# EasyEDA Pro project icl7109-rp2040-precision-meter_2025-05-16.epro, schematic icl7109-rp2040-precision-meter
Board Name: 树莓派Board1_4; Create Date: 2025-05-10; Page Name: P1; Project Name: ICL7109检测电路; Schematic Name: 树莓派Schematic1_4; Update Date: 2025-05-13; Company: 嘉立创EDA; Page Size: A4; Version: V1.0
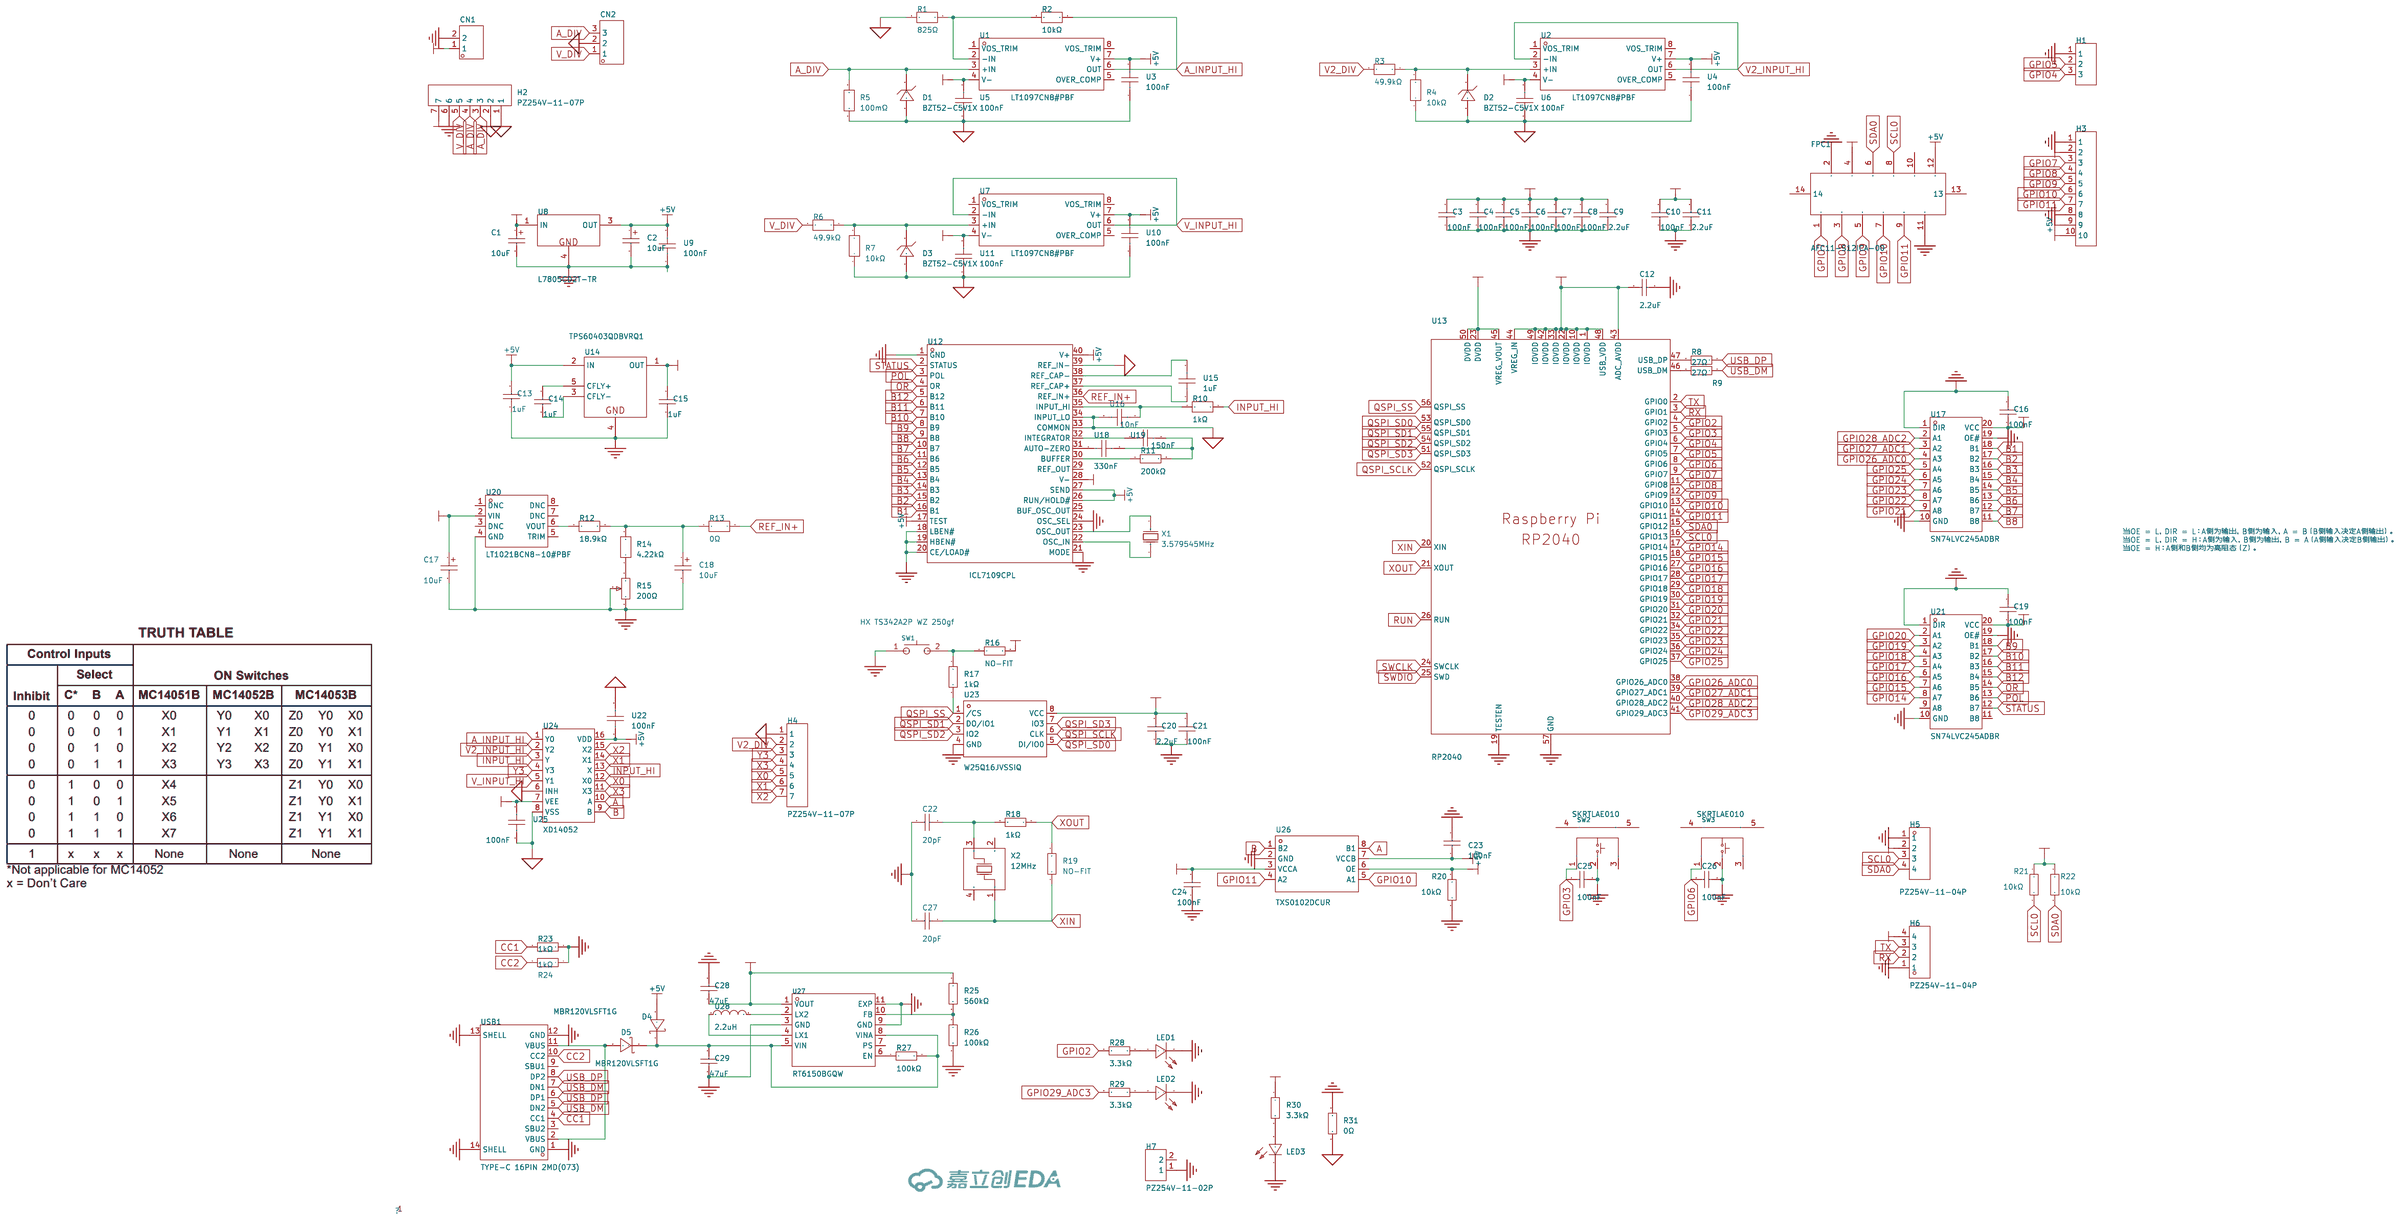
[diagram p0: schematic sheet]

## Parts
C1  10uF  [CAP-SMD_L7.3-W4.3-FD]
C2  10uF  [case-b_3528]
C3  100nF  [C0805]
C4  100nF  [C0805]
C5  100nF  [C0805]
C6  100nF  [C0805]
C7  100nF  [C0805]
C8  100nF  [C0805]
C9  2.2uF  [C0805]
C10  100nF  [C0805]
C11  2.2uF  [C0805]
C12  2.2uF  [C0805]
C13  1uF  [C0805]
C14  1uF  [C0805]
C15  1uF  [C0805]
C16  100nF  [C0805]
C17  10uF  [CAP-SMD_L7.3-W4.3-FD]
C18  10uF  [case-b_3528]
C19  100nF  [C0805]
C20  2.2uF  [C0805]
C21  100nF  [C0805]
C22  20pF  [C0805]
C23  100nF  [C0805]
C24  100nF  [C0805]
C25  100nF  [C0805]
C26  100nF  [C0805]
C27  20pF  [C0805]
C28  47uF  [C0805]
C29  47uF  [C0805]
CN1  WJ15EDGVC-3.81-2P  [CONN-TH_WJ15EDGVC-3.81-2P]
CN2  WJ15EDGVC-3.81-3P  [CONN-TH_3P-P3.81_WJ15EDGVC-3.81-3P]
D1  BZT52-C5V1X  [SOD-123_L2.7-W1.6-LS3.7-RD]
D2  BZT52-C5V1X  [SOD-123_L2.7-W1.6-LS3.7-RD]
D3  BZT52-C5V1X  [SOD-123_L2.7-W1.6-LS3.7-RD]
D4  MBR120VLSFT1G  [SOD-123F_L2.8-W1.8-LS3.7-RD]
D5  MBR120VLSFT1G  [SOD-123F_L2.8-W1.8-LS3.7-RD]
FPC1  AFC11-S12ICA-00  [CONN-SMD-12P_AFC11-S12ICA-00]
H1  PZ254V-11-03P  [HDR-TH_3P-P2.54-V-M]
H2  PZ254V-11-07P  [HDR-TH_7P-P2.54-V-M]
H3  PZ254V-11-10P  [HDR-TH_10P-P2.54-V-M]
H4  PZ254V-11-07P  [HDR-TH_7P-P2.54-V-M]
H5  PZ254V-11-04P  [HDR-TH_4P-P2.54-V-M]
H6  PZ254V-11-04P  [HDR-TH_4P-P2.54-V-M]
H7  PZ254V-11-02P  [HDR-TH_2P-P2.54-V-M]
LED1  LTST-C190KSKT  [LED0603-RD]
LED2  LTST-C190KSKT  [LED0603-RD]
LED3  NCD0603R1  [LED0603-RD_RED]
R1  825Ω  [RES-TH_BD2.7-L6.2-P10.20-D0.4]
R2  10kΩ  [RES-TH_BD2.7-L6.2-P10.20-D0.4]
R3  49.9kΩ  [RES-TH_BD2.7-L6.2-P10.20-D0.4]
R4  10kΩ  [RES-TH_BD2.7-L6.2-P10.20-D0.4]
R5  100mΩ  [RES-SMD_L6.4-W3.2-R2512]
R6  49.9kΩ  [RES-TH_BD2.7-L6.2-P10.20-D0.4]
R7  10kΩ  [RES-TH_BD2.7-L6.2-P10.20-D0.4]
R8  27Ω  [r0805]
R9  27Ω  [r0805]
R10  1kΩ  [RES-TH_BD2.7-L6.2-P10.20-D0.4]
R11  200kΩ  [R1206]
R12  18.9kΩ  [RES-TH_BD2.7-L6.2-P10.20-D0.4]
R13  0Ω  [RES-TH_BD2.7-L6.2-P10.20-D0.4]
R14  4.22kΩ  [RES-TH_BD2.7-L6.2-P10.20-D0.4]
R15  200Ω  [RES-ADJ-TH_3P-L9.5-W9.5-P2.54-BR-BS]
R16  NO-FIT  [r0805]
R17  1kΩ  [r0805]
R18  1kΩ  [r0805]
R19  NO-FIT  [r0805]
R20  10kΩ  [r0805]
R21  10kΩ  [r0805]
R22  10kΩ  [r0805]
R23  1kΩ  [r0805]
R24  1kΩ  [r0805]
R25  560kΩ  [R0603]
R26  100kΩ  [R0603]
R27  100kΩ  [R0603]
R28  3.3kΩ  [r0805]
R29  3.3kΩ  [r0805]
R30  3.3kΩ  [r0805]
R31  0Ω  [R1206]
SW1  HX TS342A2P WZ 250gf  [SW-SMD_L4.0-W2.9-LS5.0]
SW2  SKRTLAE010  [KEY-SMD_SKRTLAE010]
SW3  SKRTLAE010  [KEY-SMD_SKRTLAE010]
U1  LT1097CN8#PBF  [PDIP-8_L9.3-W6.4-P2.54-LS7.6-BL]
U2  LT1097CN8#PBF  [PDIP-8_L9.3-W6.4-P2.54-LS7.6-BL]
U3  100nF  [CAP-TH_L3.8-W2.5-P5.08-D0.50]
U4  100nF  [CAP-TH_L3.8-W2.5-P5.08-D0.50]
U5  100nF  [CAP-TH_L3.8-W2.5-P5.08-D0.50]
U6  100nF  [CAP-TH_L3.8-W2.5-P5.08-D0.50]
U7  LT1097CN8#PBF  [PDIP-8_L9.3-W6.4-P2.54-LS7.6-BL]
U8  L7805CD2T-TR  [TO-263-2_L10.0-W9.1-P5.08-LS15.2-TL]
U9  100nF  [CAP-TH_L3.8-W2.5-P5.08-D0.50]
U10  100nF  [CAP-TH_L3.8-W2.5-P5.08-D0.50]
U11  100nF  [CAP-TH_L3.8-W2.5-P5.08-D0.50]
U12  ICL7109CPL  [PDIP-40_L52.3-W13.8-P2.54-LS15.2-BL]
U13  RP2040  [LQFN-56_L7.0-W7.0-P0.4-EP]
U14  TPS60403QDBVRQ1  [SOT-23-5_L3.0-W1.7-P0.95-LS2.8-BR]
U15  1uF  [CAP-TH_L13.0-W5.0-P10.00-D0.6]
U16  10nF  [CAP-TH_L3.8-W2.5-P5.08-D0.50]
U17  SN74LVC245ADBR  [SSOP-20_L7.5-W5.2-P0.65-LS8.0-BL]
U18  330nF  [CAP-TH_L18.0-W6.0-P15.00-D0.8]
U19  150nF  [CAP-TH_L13.0-W5.0-P10.00-D0.6]
U20  LT1021BCN8-10#PBF  [PDIP-8_L9.3-W6.4-P2.54-LS7.6-BL]
U21  SN74LVC245ADBR  [SSOP-20_L7.5-W5.2-P0.65-LS8.0-BL]
U22  100nF  [CAP-TH_L3.8-W2.5-P5.08-D0.50]
U23  W25Q16JVSSIQ  [SOIC-8_L5.3-W5.3-P1.27-LS8.0-BL]
U24  XD14052  [DIP-16_L19.2-W6.6-P2.54-LS7.6-BL]
U25  100nF  [CAP-TH_L3.8-W2.5-P5.08-D0.50]
U26  TXS0102DCUR  [VSON8_L2.0-W2.3-P0.50-LS3.1-BL]
U27  RT6150BGQW  [WSON-10_L2.5-W2.5-P0.50-BL-EP]
U28  2.2uH  [IND-SMD_L2.5-W2.0-B]
USB1  TYPE-C 16PIN 2MD(073)  [USB-C-SMD_TYPE-C-6PIN-2MD-073]
X1  3.579545MHz  [HC-49US_L11.5-W4.5-P4.88]
X2  12MHz  [OSC-SMD_4P-L3.2-W2.5-BL]

## Library data of the parts
C1 C17 = T491X476K035AT: 容值:47uF;精度:±10%;额定电压:35V;等效串联电阻:600mΩ@100kHz;; LCSC Part Name: 47uF ±10% 35V; Supplier Part: C87110; Manufacturer: KEMET(基美); Supplier Footprint: CASE-X-7343; JLCPCB Part Class: 扩展库; Datasheet: https://atta.szlcsc.com/upload/public/pdf/source/20190402/C118128_17DC26F5D7668F0165447CB640F1E367.pdf; Supplier: LCSC; Tolerance: ±10%; Rated Voltage: 35V; Equivalent Series Resistance(ESR): 600mΩ@100kHz; Operating Temperature: -55℃~+125℃
C2 C18 = T491B106K025AT: 容值:10uF;精度:±10%;额定电压:25V;等效串联电阻:2Ω@100kHz;; LCSC Part Name: 10uF ±10% 25V; Supplier Part: C110053; Manufacturer: KEMET(基美); Supplier Footprint: CASE-B-3528-21(mm); JLCPCB Part Class: 扩展库; Datasheet: https://atta.szlcsc.com/upload/public/pdf/source/20190402/C118128_17DC26F5D7668F0165447CB640F1E367.pdf; Supplier: LCSC; Tolerance: ±10%; Rated Voltage: 25V; Equivalent Series Resistance(ESR): 2Ω@100kHz; Operating Temperature: -55℃~+125℃
C3-C16 C19-C22 C25-C29 = CC0805KRX7R9BB104: 容值:100nF;精度:±10%;额定电压:50V;材质(温度系数):X7R;; LCSC Part Name: 100nF ±10% 50V; Supplier Part: C49678; Manufacturer: YAGEO(国巨); Supplier Footprint: 0805; JLCPCB Part Class: 基础库; Datasheet: https://atta.szlcsc.com/upload/public/pdf/source/20180224/C181747_15194369449651363981.pdf; Supplier: LCSC; Tolerance: ±10%; Voltage Rated: 50V; Temperature Coefficient: X7R
C23 C24 = 0805B104K500NT: 容值:100nF;精度:±10%;额定电压:50V;材质(温度系数):X7R;; LCSC Part Name: 100nF ±10% 50V; Supplier Part: C38141; Manufacturer: FH(风华); Supplier Footprint: 0805; JLCPCB Part Class: 扩展库; Datasheet: https://atta.szlcsc.com/upload/public/pdf/source/20200305/C486355_26A10D38EF8C2A5C37091D0039909270.pdf; Supplier: LCSC; Tolerance: ±10%; Voltage Rated: 50V; Temperature Coefficient: X7R
CN1 = WJ15EDGVC-3.81-2P: 连接器类型:板端/插座-闭口;固定方式:-;结构:1x2P;间距:3.81mm;颜色:-;安装方式:直针;排数:1;每排PIN数:2;额定电流:8A;额定电压:300V;线规 - AWG:-;线规 - 平方毫米:-;触头材质:黄铜;触头镀层:锡;工作温度范围:-40℃~+105℃;焊接温度(最大值):-;; LCSC Part Name: 1x2P 3.81mm 排数:1 每排P数:2; Supplier Part: C8396; Manufacturer: KANGNEX(康奈克斯电气); Supplier Footprint: 插件,P=3.81mm; JLCPCB Part Class: 扩展库; Datasheet: https://atta.szlcsc.com/upload/public/pdf/source/20191225/C8396_DFFE6D58C2AF45781C2AF0BF2B733CCC.pdf; Supplier: LCSC; Connector Type: 板端/插座-闭口; Structure: 1x2P; Pitch: 3.81mm; Mounting Style: 直针; Number of Pins: 2P; Number of Rows: 1; Number of PINs Per Row: 2; Current Rating (Max): 8A; Voltage Rating (Max): 300V; Contact Material: 黄铜; Contact Plating: 锡; Operating Temperature Range: -40℃~+105℃
CN2 = WJ15EDGVC-3.81-3P: 连接器类型:板端/插座-闭口;固定方式:-;结构:1x3P;间距:3.81mm;颜色:-;安装方式:直针;排数:1;每排PIN数:3;额定电流:8A;额定电压:300V;线规 - AWG:-;线规 - 平方毫米:-;触头材质:黄铜;触头镀层:锡;工作温度范围:-40℃~+105℃;焊接温度(最大值):-;; LCSC Part Name: 1x3P 3.81mm 排数:1 每排P数:3; Supplier Part: C8389; Manufacturer: KANGNEX(康奈克斯电气); Supplier Footprint: 插件,P=3.81mm; JLCPCB Part Class: 扩展库; Datasheet: https://atta.szlcsc.com/upload/public/pdf/source/20191225/C8389_B21BE5A0E910B8F69CE6926ACBB2B491.pdf; Supplier: LCSC; Connector Type: 板端/插座-闭口; Structure: 1x3P; Pitch: 3.81mm; Mounting Style: 直针; Number of Pins: 3P; Number of Rows: 1; Number of PINs Per Row: 3; Current Rating (Max): 8A; Voltage Rating (Max): 300V; Contact Material: 黄铜; Contact Plating: 锡; Operating Temperature Range: -40℃~+105℃
D1-D3 = BZT52-C5V1X: 稳压值(标称值):5.1V;功率(Pd):350mW;; Supplier Part: C550301; Manufacturer: Nexperia(安世); Supplier Footprint: SOD-123; JLCPCB Part Class: 扩展库; Datasheet: https://atta.szlcsc.com/upload/public/pdf/source/20200610/C550302_6745180D178DB30731460AF0B8A8D2F3.pdf; Supplier: LCSC; Zener Voltage (Nom): 5.1V; Reverse Leakage Current (Ir): 2uA@2V; Power Dissipation: 350mW; Zener Impedance (Zzt): 60Ω
D4 D5 = MBR120VLSFT1G: 正向压降(Vf):300mV@1A;直流反向耐压(Vr):20V;平均整流电流(Io):1A;; LCSC Part Name: 电压:20V 电流:1A; Supplier Part: C223608; Manufacturer: onsemi(安森美); Supplier Footprint: SOD-123FL; JLCPCB Part Class: 扩展库; Datasheet: https://atta.szlcsc.com/upload/public/pdf/source/20221020/29D26ECD33A75D76A8E47ED9553F3BCF.pdf; Supplier: LCSC; Forward Voltage (Vf@If): 300mV@1A; Reverse Voltage (Vr): 20V; Average Rectified Current (Io): 1A; Reverse Leakage Current (Ir): 600uA@20V
FPC1 = AFC11-S12ICA-00: 锁定特性:抽屉式;触点类型:单侧触点/垂直;触点数量:12P;间距:0.5mm;安装类型:立贴;; LCSC Part Name: 间距:0.5mm P数:12P 抽屉式 单侧触点/垂直; Supplier Part: C262499; Manufacturer: JS(钜硕电子); Supplier Footprint: SMD,P=0.5mm; JLCPCB Part Class: 扩展库; Datasheet: https://atta.szlcsc.com/upload/public/pdf/source/20191211/C466537_F6F2472ADACFFA77E875AFE9DAB8E0AD.pdf; Supplier: LCSC; Locking Feature: 抽屉式; Contact Type: 单侧触点/垂直; Number of Contacts: 12P; Pitch: 0.5mm; Mounting Type: 立贴; FFC, FCB Thickness: 0.3mm; Height Above Board: 4.4mm
H1 = PZ254V-11-03P: 插针结构:1x3P;间距:2.54mm;行距:-;圆针/方针:方针;安装方式:直插;排数:单排;总PIN位数:3P;额定电流:3A;额定电压:250V;配合针长度:6mm;塑高:2.5mm;端接针长度:3mm;工作温度:-40℃~+105℃;颜色:黑色;; LCSC Part Name: 1x3P 间距:2.54mm 方针 直插; Supplier Part: C2937625; Manufacturer: XFCN(兴飞); Supplier Footprint: 插件,P=2.54mm; JLCPCB Part Class: 扩展库; Datasheet: https://atta.szlcsc.com/upload/public/pdf/source/20200309/C492402_8335C3D49C4E4C618838D59BB1D024C1.pdf; Supplier: LCSC; Pin Structure: 1x3P; Pitch: 2.54mm; Circluar Pins/Square Pins: 方针; Mounting Type: 直插; Number of Rows: 单排; Number of Pins: 3P; Current Rating: 3A; Voltage Rating (Max): 250V; Length of Mating Pin: 6mm; Insulation Height: 2.5mm; Length of End Connection Pin: 3mm; Operating Temperature: -40℃~+105℃; Color: 黑色
H2 H4 = PZ254V-11-07P: 插针结构:1x7P;间距:2.54mm;行距:-;圆针/方针:方针;安装方式:直插;排数:单排;总PIN位数:7P;额定电流:-;额定电压:-;配合针长度:6mm;塑高:2.5mm;端接针长度:3mm;触头材质:黄铜;触头镀层:-;工作温度:-40℃~+105℃;颜色:黑色;; LCSC Part Name: 1x7P 间距:2.54mm 方针 直插; Supplier Part: C492406; Manufacturer: XFCN(兴飞); Supplier Footprint: 插件,P=2.54mm; JLCPCB Part Class: 扩展库; Datasheet: https://atta.szlcsc.com/upload/public/pdf/source/20200309/C492406_654C533EE691117E22DD9F76C114C2D9.pdf; Supplier: LCSC; Pin Structure: 1x7P; Pitch: 2.54mm; Circluar Pins/Square Pins: 方针; Mounting Type: 直插; Number of Rows: 单排; Number of Pins: 7P; Length of Mating Pin: 6mm; Insulation Height: 2.5mm; Length of End Connection Pin: 3mm; Contact Material: 黄铜; Operating Temperature: -40℃~+105℃; Color: 黑色
H3 = PZ254V-11-10P: 插针结构:1x10P;间距:2.54mm;行距:-;圆针/方针:方针;安装方式:直插;排数:单排;总PIN位数:10P;额定电流:-;额定电压:-;配合针长度:6mm;塑高:2.5mm;端接针长度:3mm;触头材质:黄铜;触头镀层:-;工作温度:-40℃~+105℃;颜色:黑色;; LCSC Part Name: 1x10P 间距:2.54mm 方针 直插; Supplier Part: C492409; Manufacturer: XFCN(兴飞); Supplier Footprint: 插件,P=2.54mm; JLCPCB Part Class: 扩展库; Datasheet: https://atta.szlcsc.com/upload/public/pdf/source/20200309/C492409_129C9431BDD62EBBBD0A643B6AAB9FBD.pdf; Supplier: LCSC; Pin Structure: 1x10P; Pitch: 2.54mm; Circluar Pins/Square Pins: 方针; Mounting Type: 直插; Number of Rows: 单排; Number of Pins: 10P; Length of Mating Pin: 6mm; Insulation Height: 2.5mm; Length of End Connection Pin: 3mm; Contact Material: 黄铜; Operating Temperature: -40℃~+105℃; Color: 黑色
H5 H6 = PZ254V-11-04P: 插针结构:1x4P;间距:2.54mm;行距:-;圆针/方针:方针;安装类型:直插;排数:单排;总PIN位数:4P;额定电流:3A;额定电压:250V;配合针长度:6mm;塑高:2.5mm;端接针长度:3mm;触头材质:-;工作温度范围:-40℃~+105℃;颜色:黑色;; LCSC Part Name: 间距:2.54mm 1x4P 直插 方针; Supplier Part: C2691448; Manufacturer: XFCN(兴飞); Supplier Footprint: 插件,P=2.54mm; JLCPCB Part Class: 扩展库; Datasheet: https://atta.szlcsc.com/upload/public/pdf/source/20200309/C492403_F9F19131791D08044AD4F84F8E751A34.pdf; Supplier: LCSC; Pin Structure: 1x4P; Pitch: 2.54mm; Circluar Pins/Square Pins: 方针; Mounting Type: 直插; Number of Rows: 单排; Number of Pins: 4P; Current Rating (Max): 3A; Voltage Rating (Max): 250V; Length of Mating Pin: 6mm; Insulation Height: 2.5mm; Length of End Connection Pin: 3mm; Operating Temperature Range: -40℃~+105℃; Color: 黑色
H7 = PZ254V-11-02P: 插针结构:1x2P;间距:2.54mm;行距:-;圆针/方针:方针;安装方式:直插;排数:单排;总PIN位数:2P;额定电流:-;额定电压:-;配合针长度:6mm;塑高:2.5mm;端接针长度:3mm;触头材质:黄铜;触头镀层:-;工作温度:-40℃~+105℃;颜色:黑色;; LCSC Part Name: 1x2P 间距:2.54mm 方针 直插; Supplier Part: C492401; Manufacturer: XFCN(兴飞); Supplier Footprint: 插件,P=2.54mm; JLCPCB Part Class: 扩展库; Datasheet: https://atta.szlcsc.com/upload/public/pdf/source/20200309/C492401_A812433581A9B211A7FFA413ADDFF0E5.pdf; Supplier: LCSC; Pin Structure: 1x2P; Pitch: 2.54mm; Circluar Pins/Square Pins: 方针; Mounting Type: 直插; Number of Rows: 单排; Number of Pins: 2P; Length of Mating Pin: 6mm; Insulation Height: 2.5mm; Length of End Connection Pin: 3mm; Contact Material: 黄铜; Operating Temperature: -40℃~+105℃; Color: 黑色
LED1 LED2 = LTST-C190KSKT: 发光颜色:黄色;正向电压(VF):2.1V;功率:75mW;正向电流:20mA;主波长:584.5nm~597nm;二极管配置:-;透镜颜色:无色透明透镜;色温:-;发光强度:104mcd;发光角度:130°;载带方式:-;工作温度:-30℃~+85℃;; LCSC Part Name: 黄灯; Supplier Part: C125095; Manufacturer: LITEON(光宝); Supplier Footprint: 0603; JLCPCB Part Class: 扩展库; Datasheet: https://atta.szlcsc.com/upload/public/pdf/source/20180129/C125095_15171881843821315881.pdf; Supplier: LCSC; Emitted Color: 黄色; Forward Voltage (VF): 2.1V; Power Dissipation: 75mW; Forward Current: 20mA; Dominant Wavelength: 584.5nm~597nm; Peak Wavelength: 588nm; Lens Color: 无色透明透镜; Luminous Intensity: 104mcd; Viewing Angle: 130°; Operating Temperature: -30℃~+85℃
LED3 = NCD0603R1_C84263: 灯头类型:-;发光颜色:红色;正向电压(VF):1.6V~2.6V;功率:65mW;正向电流:20mA;主波长:615nm~630nm;二极管配置:独立二极管;透镜颜色:无色透明透镜;色温:-;发光强度:80mcd~220mcd;发光角度:130°;载带方式:-;工作温度:-30℃~+85℃;; Supplier Part: C84263; Manufacturer: 国星光电; Supplier Footprint: 0603; JLCPCB Part Class: 扩展库; Datasheet: https://atta.szlcsc.com/upload/public/pdf/source/20200820/C84263_DABC6A75E58F576973B407FDBA283D60.pdf; Supplier: LCSC; Emitted Color: 红色; Forward Voltage (VF): 1.6V~2.6V; Power Dissipation: 65mW; Forward Current: 20mA; Dominant Wavelength: 615nm~630nm; Diode Configuration: 独立二极管; Lens Color: 无色透明透镜; Luminous Intensity: 80mcd~220mcd; Viewing Angle: 130°; Operating Temperature: -30℃~+85℃
R1-R4 R6 R7 R10 R12-R14 = MF1/4W-1K±1%-ST52: 电阻类型:金属膜电阻;阻值:1kΩ;精度:±1%;功率:250mW;温度系数:±100ppm/℃;; LCSC Part Name: 金属膜电阻 1kΩ ±1% 250mW; Supplier Part: C2903245; Manufacturer: VO(翔胜); Supplier Footprint: 插件,D2.7xL6.2mm; JLCPCB Part Class: 扩展库; Datasheet: https://atta.szlcsc.com/upload/public/pdf/source/20200609/C601728_5AA4C0C8E12E11069DA2C3356F29D1F2.pdf; Supplier: LCSC; Type: 金属膜电阻; Tolerance: ±1%; Overload Voltage (Max): 250V; Power(Watts): 250mW; Temperature Coefficient: ±100ppm/℃; Operating Temperature Range: -55℃~+155℃
R5 = HoJLR2512-3W-100mR-1%: 电阻类型:采样电阻;阻值:100mΩ;精度:±1%;功率:3W;安装方式:贴片;; LCSC Part Name: 100mΩ ±1% 3W; Supplier Part: C2903476; Manufacturer: Milliohm(毫欧); Supplier Footprint: 2512; JLCPCB Part Class: 扩展库; Datasheet: https://atta.szlcsc.com/upload/public/pdf/source/20211009/7525CABAB363C979E942C1DD41F1FEF0.pdf; Supplier: LCSC; Type: 采样电阻; Tolerance: ±1%; Power(Watts): 3W; Mounting Sytle: 贴片
R8 R9 R16-R19 R23-R29 = 0805W8F1000T5E: 电阻类型:厚膜电阻;阻值:100Ω;精度:±1%;功率:125mW;最大工作电压:150V;温度系数:±100ppm/℃;; LCSC Part Name: 100Ω ±1% 125mW 厚膜电阻; Supplier Part: C17408; Manufacturer: UNI-ROYAL(厚声); Supplier Footprint: 0805; JLCPCB Part Class: 基础库; Datasheet: https://atta.szlcsc.com/upload/public/pdf/source/20200306/C422600_1E6D84923E4A46A82E41ADD87F860B5C.pdf; Supplier: LCSC; Type: 厚膜电阻; Tolerance: ±1%; Power(Watts): 125mW; Overload Voltage (Max): 150V; Temperature Coefficient: ±100ppm/℃; Operating Temperature Range: -55℃~+155℃
R11 R31 = 1206W4F0000T5E: 电阻类型:厚膜电阻;阻值:0Ω;精度:±1%;功率:250mW;最大工作电压:200V;温度系数:±800ppm/℃;; LCSC Part Name: 0Ω ±1% 250mW 厚膜电阻; Supplier Part: C17888; Manufacturer: UNI-ROYAL(厚声); Supplier Footprint: 1206; JLCPCB Part Class: 基础库; Datasheet: https://atta.szlcsc.com/upload/public/pdf/source/20200306/C422600_1E6D84923E4A46A82E41ADD87F860B5C.pdf; Supplier: LCSC; Type: 厚膜电阻; Tolerance: ±1%; Power(Watts): 250mW; Overload Voltage (Max): 200V; Temperature Coefficient: ±800ppm/℃; Operating Temperature Range: -55℃~+155℃
R15 = 3386P-1-103LF: 阻值:10kΩ;精度:±10%;功率:500mW;温度系数:±100ppm/℃;; LCSC Part Name: 10kΩ ±10%; Supplier Part: C116281; Manufacturer: BOURNS; Supplier Footprint: 插件-3P,9.5x9.5mm; JLCPCB Part Class: 扩展库; Datasheet: https://atta.szlcsc.com/upload/public/pdf/source/20180903/C238823_A95558D6D946A98334AD6D09E3E566F9.pdf; Supplier: LCSC; Tolerance: ±10%; Power(Watts): 500mW; Temperature Coefficient: ±100ppm/℃; Turns: 1
R20-R22 = 0805W8F1002T5E_C17414: 电阻类型:厚膜电阻;阻值:10kΩ;精度:±1%;功率:125mW;最大工作电压:150V;温度系数:±100ppm/℃;; LCSC Part Name: 10kΩ ±1% 125mW 厚膜电阻; Supplier Part: C17414; Manufacturer: UNI-ROYAL(厚声); Manufacturer Part: 0805W8F1002T5E; Supplier Footprint: 0805; JLCPCB Part Class: 基础库; Datasheet: https://atta.szlcsc.com/upload/public/pdf/source/20200306/C422600_1E6D84923E4A46A82E41ADD87F860B5C.pdf; Supplier: LCSC; Type: 厚膜电阻; Tolerance: ±1%; Power(Watts): 125mW; Overload Voltage (Max): 150V; Temperature Coefficient: ±100ppm/℃; Operating Temperature Range: -55℃~+155℃
R30 = RC0402FR-07470RL: 阻值:470Ω;最大工作电压:50V;工作温度范围:-55℃~+155℃;电阻长:-;精度:±1%;电阻直径:-;电阻高:-;电阻宽:-;电阻类型:厚膜电阻;功率:62.5mW;温度系数:±100ppm/℃;; LCSC Part Name: 470Ω ±1%; Supplier Part: C114877; Manufacturer: YAGEO(国巨); Supplier Footprint: 0402; JLCPCB Part Class: 扩展库; Datasheet: https://atta.szlcsc.com/upload/public/pdf/source/20170912/C114877_1505207821835963485.pdf; Supplier: LCSC; Overload Voltage (Max): 50V; Operating Temperature Range: -55℃~+155℃; Tolerance: ±1%; Type: 厚膜电阻; Power(Watts): 62.5mW; Temperature Coefficient: ±100ppm/℃
SW1 = HX TS342A2P WZ 250gf: 开关长度:4mm;开关宽度:3mm;开关高度:2.5mm;机械寿命:-;; LCSC Part Name: 4*3*2.5mm 立贴 轻触开关; Supplier Part: C5143624; Manufacturer: hanxia(韩下); Supplier Footprint: SMD; JLCPCB Part Class: 扩展库; Datasheet: https://atta.szlcsc.com/upload/public/pdf/source/20220824/BD4643BA1524EF20DD35ADAFF82B8650.pdf; Supplier: LCSC; Switch Length: 4mm; Switch Width: 3mm; Switch Height: 2.5mm
SW2 SW3 = SKRTLAE010: 电路结构:单刀单掷;按钮形状:圆形按钮;安装方式:卧贴;开关长度:4.5mm;开关宽度:3.4mm;开关高度:3.3mm;触点电流:50mA;额定电压(DC):12V;带灯:-;机械寿命:-;; LCSC Part Name: 4.5*3.4*3.3mm 卧贴 轻触开关; Supplier Part: C110293; Manufacturer: ALPSALPINE(阿尔卑斯阿尔派); Supplier Footprint: SMD; JLCPCB Part Class: 扩展库; Datasheet: https://atta.szlcsc.com/upload/public/pdf/source/20170428/1493376812809.pdf; Supplier: LCSC; Circuit: 单刀单掷; Actuator Style: 圆形按钮; Mounting Style: 卧贴; Switch Length: 4.5mm; Switch Width: 3.4mm; Switch Height: 3.3mm; Contact Current: 50mA; Voltage Rating (DC): 12V
U1 U2 U7 = LT1097CN8#PBF: 放大器数:单路;增益带宽积(GBP):700kHz;压摆率(SR):0.2V/us;输入偏置电流(Ib):40pA;; LCSC Part Name: 低成本、低功率、高精度运算放大器; Supplier Part: C662019; Manufacturer: ADI(亚德诺); Supplier Footprint: PDIP-8; JLCPCB Part Class: 扩展库; Datasheet: https://atta.szlcsc.com/upload/public/pdf/source/20200624/C662019_7558F4B69221AA36721EF812CEE5C0AA.pdf; Supplier: LCSC; Number of Circuits: 单路; Gain Bandwidth Product(GBP): 700kHz; Slew Rate(SR): 0.2V/us; Current - Input Bias(Ib): 40pA; Operating Temperature: -40℃~+85℃
U3-U6 U9-U11 U16 U22 U25 = A104K15X7RF5UAA: 容值:100nF;精度:±10%;额定电压:50V;温度系数:X7R;; LCSC Part Name: 100nF ±10% 50V; Supplier Part: C1620057; Manufacturer: VISHAY(威世); Supplier Footprint: 插件,D2.5xL3.8mm; JLCPCB Part Class: 扩展库; Datasheet: https://atta.szlcsc.com/upload/public/pdf/source/20210630/2D198A6344B58DDF852CFB19135430C4.pdf; Supplier: LCSC; Tolerance: ±10%; Voltage Rated: 50V; Temperature Coefficient: X7R
U8 = L7805CD2T-TR: 输出类型:固定;最大输入电压:35V;输出电压:5V;输出电流:1.5A;电源纹波抑制比(PSRR):62dB@(120Hz);输出极性:正极;; LCSC Part Name: 正稳压器IC; Supplier Part: C15077; Manufacturer: ST(意法半导体); Supplier Footprint: TO-263-2; JLCPCB Part Class: 扩展库; Datasheet: https://atta.szlcsc.com/upload/public/pdf/source/20191219/C472632_C0855675BBC73B8C8E44EE1325AAD56A.pdf; Supplier: LCSC; Output Type: 固定; Maximum Input Voltage: 35V; Output Voltage: 5V; Output Current: 1.5A; Power Supply Rejection Ratio (PSRR): 62dB@(120Hz); Dropout Voltage: 2V@(1A); standby current: 8mA; Feature: 短路保护；热保护(TSD); Operating Temperature: 0℃~+125℃; Output Polarity: 正极; Number of Outputs: 1
U12 = ICL7109CPL: ICL7109是一款高性能、CMOS、低功耗双斜率积分A/D转换器，设计用于与微处理器轻松接口。; Supplier Part: C7206688; Manufacturer: TI(德州仪器); Supplier Footprint: PDIP-40; JLCPCB Part Class: 扩展库; Datasheet: https://atta.szlcsc.com/upload/public/pdf/source/20240312/1D0835E14A990290B02A89B4AE060F05.pdf; Supplier: LCSC
U13 = RP2040_C2040: CPU内核:-;RAM总容量:264KB;GPIO端口数量:30;工作电压范围:-;CPU最大主频:133MHz;程序存储器类型:-;应用领域:-;; LCSC Part Name: RP2040（RP2B2）; Supplier Part: C2040; Manufacturer: Raspberry Pi(树莓派); Supplier Footprint: LQFN-56(7x7); JLCPCB Part Class: 扩展库; Datasheet: https://atta.szlcsc.com/upload/public/pdf/source/20210621/C2040_96F425825606B7957D87DD32E2512CA9.pdf; Supplier: LCSC; RAM Size: 264KB; GPIO Ports Number: 30; CPU Maximum Speed: 133MHz; ADC (Bit): 12bit; UART/USART: 2; I2C: 2; SPI: 2; Universal Serial Bus: 有; Peripheral/Function: DMA；PWM; Direct Memory Access: 有
U14 = TPS60403QDBVRQ1: TPS60403-Q1 具有 250kHz 固定频率的汽车类非稳压 60mA 电荷泵电压逆变器; Supplier Part: C130215; Manufacturer: TI(德州仪器); Supplier Footprint: SOT-23-5; JLCPCB Part Class: 扩展库; Datasheet: https://www.ti.com/cn/lit/gpn/tps60403-q1; Supplier: LCSC
U15 U19 = PX103K2C1002: 容值:10nF;精度:±10%;电压(AC):310V；380V；350V;等级:X2;; LCSC Part Name: 等级:X2 10nF ±10% 310V 350V 380V; Supplier Part: C5116054; Manufacturer: KYET(科雅); Supplier Footprint: 插件,P=10mm; JLCPCB Part Class: 扩展库; Datasheet: https://atta.szlcsc.com/upload/public/pdf/source/20220726/8BCDF1AE29264F5AC3BCF834660FC432.pdf; Supplier: LCSC; Tolerance: ±10%; Voltage(AC): 310V；380V；350V; Subclass: X2; safety certification: UL；ENEC；CQC; Operating Temperature: -40℃~+110℃
U17 U21 = SN74LVC245ADBR: SN74LVC245A 具有三态输出的八通道总线收发器; Supplier Part: C393617; Manufacturer: TI(德州仪器); Supplier Footprint: SSOP-20-5.2mm; JLCPCB Part Class: 扩展库; Datasheet: https://www.ti.com/cn/lit/gpn/sn74lvc245a; Supplier: LCSC
U18 = MPX334K31D2KN15800: 容值:330nF;精度:±10%;电压(AC):275V；310V；305V;等级:X2;; LCSC Part Name: 330nF ±10% 275V 305V 310V 等级:X2; Supplier Part: C504201; Manufacturer: KNSCHA(科尼盛); Supplier Footprint: 插件,P=15mm; JLCPCB Part Class: 扩展库; Datasheet: https://atta.szlcsc.com/upload/public/pdf/source/20200409/C504201_262CED3AA358BCF37F005B56DB63EB22.pdf; Supplier: LCSC; Tolerance: ±10%; Voltage(AC): 275V；310V；305V; Subclass: X2; safety certification: UL；CUL；KC；ENEC；VDE；CQC; Operating Temperature: -40℃~+110℃
U20 = LT1021BCN8-10#PBF: 输出类型:固定;工作电压:11.5V~40V;输出电压:10V;输出电流:10mA;精度:±0.5%;; LCSC Part Name: 精准型基准; Supplier Part: C661976; Manufacturer: ADI(亚德诺); Supplier Footprint: PDIP-8; JLCPCB Part Class: 扩展库; Datasheet: https://atta.szlcsc.com/upload/public/pdf/source/20170712/C117239_1499832351853814423.pdf; Supplier: LCSC; Output Type: 固定; Input Voltage: 11.5V~40V; Output Voltage: 10V; Output Current: 10mA; Tolerance: ±0.5%; Temperature Coefficient: 5ppm/℃; Reference Type: 串联；并联; Supply Current: 2mA; Noise - 1/10Hz to 10Hz: 3uVp-p; Noise - 10Hz to 10kHz: 2.2uVrms; Operating Temperature: 0℃~+70℃@(Ta)
U23 = W25Q16JVSSIQ_C131025: （与C82317为同一颗物料，只是编带方式不一样。）3V 16Mbit Serial Flash Memory with dual/quad SPI; Supplier Part: C131025; Manufacturer: WINBOND(华邦); Supplier Footprint: SOIC-8-208mil; JLCPCB Part Class: 扩展库; Datasheet: https://atta.szlcsc.com/upload/public/pdf/source/20210318/C131025_490139441AABAB3970D06D5A0D9163A5.pdf; Supplier: LCSC
U24 = XD14052: 接口 - 模拟开关，多路复用器，多路分解器 2 电路 IC 开关 2：4 280 欧姆; LCSC Part Name: 多路复用开关 IC; Supplier Part: C556249; Manufacturer: XINLUDA(信路达); Supplier Footprint: DIP-16; JLCPCB Part Class: 扩展库; Datasheet: https://atta.szlcsc.com/upload/public/pdf/source/20241028/5B15AD3044D60F225E5C35DF48401CBC.pdf; Supplier: LCSC
U26 = TXS0102DCUR: 数据速率:24Mbps;电压(VCCA):1.65V~3.6V;电压(VCCB):2.3V~5.5V;电路数:1;每个电路通道数:2;; LCSC Part Name: 24Mbps 2位双向电平转换器; Supplier Part: C53434; Manufacturer: TI(德州仪器); Supplier Footprint: VSSOP-8; JLCPCB Part Class: 扩展库; Datasheet: https://www.ti.com/cn/lit/gpn/txs0102; Supplier: LCSC; Channel Type: 双向; Data Rate: 24Mbps; Supply Voltage (VCCA): 1.65V~3.6V; Supply Voltage (VCCB): 2.3V~5.5V; Number of Circuits: 1; Channels per Circuit: 2; Output Type: 开路漏极；推挽式; Operating Temperature: -40℃~+85℃; Features: 自动方向检测
U27 = RT6150BGQW: 功能类型:升降压型;输入电压:1.8V~5.5V;输出电压:1.8V~5.5V;输出电流(最大值):800mA;; Supplier Part: C147972; Manufacturer: RICHTEK(立锜); Supplier Footprint: WSON-10-EP(2.5x2.5); JLCPCB Part Class: 扩展库; Datasheet: https://atta.szlcsc.com/upload/public/pdf/source/20180126/C147972_15169561259341309260.pdf; Supplier: LCSC; Function: 升降压型; Input Voltage: 1.8V~5.5V; Output Voltage: 1.8V~5.5V; Output Current (Max): 800mA; Switching Frequency: 1MHz; Synchronous Rectification: 是; Number of Outputs: 1; Topology: 降压-升压式; Switch tube (built-in/external): 内置
U28 = XRIM252012S2R2MBCA: 电感值:2.2uH;精度:±20%;额定电流:3A;饱和电流(Isat):3.8A;类型:一体成型电感;; LCSC Part Name: 2.2uH ±20% 3.8A; Supplier Part: C22471111; Manufacturer: XR(祥如); Supplier Footprint: SMD,2.5x2mm; JLCPCB Part Class: 扩展库; Datasheet: https://atta.szlcsc.com/upload/public/pdf/source/20240621/1ECDA1103407935B5A4EC1FBAD577234.pdf; Supplier: LCSC; Tolerance: ±20%; Current Rating: 3A; Current - Saturation(Isat): 3.8A; DC Resistance(DCR): 55mΩ; Type: 一体成型电感
USB1 = TYPE-C 16PIN 2MD(073): 连接器类型:Type-C;标准:USB 3.1;公母:母;安装方式:卧贴;触点数量:16P;端口数量:1;额定电流 - 电源:5A;工作温度范围:-25℃~+85℃;; LCSC Part Name: Type-C 母 卧贴; Supplier Part: C2765186; Manufacturer: SHOU HAN(首韩); Supplier Footprint: SMD; JLCPCB Part Class: 扩展库; Datasheet: https://atta.szlcsc.com/upload/public/pdf/source/20211123/39B17C16241EAC15C5E277BDA434118E.pdf; Supplier: LCSC; Connector Type: Type-C; Standard: USB 3.1; Gender: 母; Mounting Style: 卧贴; Number of Contacts: 16P; Number of Ports: 1; Current Rating - Power (Max): 5A; Operating Temperature Range: -25℃~+85℃; Rated Voltage (Max): 5V; Connect-Disconnect Life: 5千次; Core Colour: 黑色
X1 = XIHCELNANF-3.579545M: 晶振类型:直插晶振;频率:3.579545MHz;常温频差:±30ppm;外接负载电容:20pF;频率稳定度(全温):±30ppm;; LCSC Part Name: 3.579545MHz ±30ppm 20pF; Supplier Part: C117861; Manufacturer: TAITIEN(泰艺电子); Supplier Footprint: HC-49S; JLCPCB Part Class: 扩展库; Datasheet: https://atta.szlcsc.com/upload/public/pdf/source/20190107/C358649_B3943D1FEB8737E4FCE005A191A94016.pdf; Supplier: LCSC; Crystal Type: 直插晶振; Normal temperature Frequency Tolerance: ±30ppm; External load capacitor: 20pF; Frequency Stability(Full temperature range): ±30ppm; Operating Temperature: -40℃~+85℃
X2 = X322512MSB4SI: 晶振类型:贴片晶振;频率:12MHz;常温频差:±10ppm;外接负载电容:20pF;频率稳定度(全温):±20ppm;; LCSC Part Name: 12MHz ±10ppm 20pF; Supplier Part: C9002; Manufacturer: YXC(扬兴晶振); Supplier Footprint: SMD3225-4P; JLCPCB Part Class: 基础库; Datasheet: https://atta.szlcsc.com/upload/public/pdf/source/20240329/19D5F850207469550BEB00D7DFEDBC7A.pdf; Supplier: LCSC; Crystal Type: 贴片晶振; Normal temperature Frequency Tolerance: ±10ppm; External load capacitor: 20pF; Frequency Stability(Full temperature range): ±20ppm; Operating Temperature: -40℃~+85℃

## Nets
+1.1V: C10.2 C11.2 U13.23(DVDD) U13.45(VREG_VOUT) U13.50(DVDD)
+3.3V: C3.2 C4.2 C5.2 C6.2 C7.2 C8.2 C9.2 C12.2 C16.1 C19.1 C20.2 C21.2 C24.2 C28.1 FPC1.4 H3.2 H5.2 H6.4 R16.2 R20.1 R21.1 R22.1 R25.1 R30.1 U13.1(IOVDD) U13.10(IOVDD) U13.22(IOVDD) U13.33(IOVDD) U13.42(IOVDD) U13.43(ADC_AVDD) U13.44(VREG_IN) U13.48(USB_VDD) U13.49(IOVDD) U17.20(VCC) U21.20(VCC) U23.8(VCC) U26.3(VCCA) U26.6(OE) U27.1(VOUT)
+5V: C2.1 C13.2 C23.1 D4.2(A) FPC1.12 H3.9 U1.7(V+) U2.7(V+) U3.2 U4.2 U7.7(V+) U8.3(OUT) U9.2 U10.2 U12.17(TEST) U12.26(RUN/HOLD#) U12.27(SEND) U12.40(V+) U14.2(IN) U22.1 U24.16(VDD) U26.7(VCCB)
-5V: C15.2 H3.10 U1.4(V-) U2.4(V-) U5.2 U6.2 U7.4(V-) U11.2 U12.28(V-) U14.1(OUT) U24.7(VEE) U25.2
AGND: CN2.2 D1.2 D2.2 D3.2 H2.1 H2.2 H4.1 R1.2 R4.1 R5.1 R7.1 R31.1 U3.1 U4.1 U5.1 U6.1 U10.1 U11.1 U12.33(COMMON) U12.34(INPUT LO) U12.39(REF IN-) U16.2 U22.2 U24.6(INH) U24.8(VSS) U25.1
GND: C1.2 C2.2 C3.1 C4.1 C5.1 C6.1 C7.1 C8.1 C9.1 C10.1 C11.1 C12.1 C13.1 C15.1 C16.2 C17.2 C18.2 C19.2 C20.1 C21.1 C22.2 C23.2 C24.1 C25.1 C26.1 C27.2 C28.2 C29.1 CN1.2 FPC1.2 FPC1.11 H1.1 H2.6 H3.1 H3.8 H5.1 H6.1 H7.1 LED1.1(-) LED2.1(-) LED3.1(K) R15.2 R15.3 R20.2 R23.1 R24.1 R26.2 R31.2 SW1.1 SW2.2 SW3.2 U8.4(GND) U9.1 U12.1(GND) U12.18(LBEN#) U12.19(HBEN#) U12.20(CE/LOAD#) U12.21(MODE) U12.24(OSC SEL) U13.19(TESTEN) U13.57(GND) U14.4(GND) U17.1(DIR) U17.10(GND) U17.19(OE#) U20.4(GND) U21.1(DIR) U21.10(GND) U21.19(OE#) U23.4(GND) U26.2(GND) U27.3(GND) U27.9(GND) U27.11(EXP) USB1.1(GND) USB1.12(GND) USB1.13(SHELL) USB1.14(SHELL)
V2_DIV: H4.2 R3.2
V2_INPUT_HI: U2.2(-IN) U2.6(OUT) U24.2(Y2)
VIN: C1.1 C17.1 CN1.1 H2.7 U8.1(IN) U20.2(VIN)
A: U24.10(A) U26.8(B1)
A_DIV: CN2.3 D1.1 H2.3 H2.4 R5.2 U1.3(+IN)
A_INPUT_HI: R2.1 U1.6(OUT) U24.1(Y0)
B: U24.9(B) U26.1(B2)
B1: U12.16(B1) U17.18(B1)
B2: U12.15(B2) U17.17(B2)
B3: U12.14(B3) U17.16(B3)
B4: U12.13(B4) U17.15(B4)
B5: U12.12(B5) U17.14(B5)
B6: U12.11(B6) U17.13(B6)
B7: U12.10(B7) U17.12(B7)
B8: U12.9(B8) U17.11(B8)
B9: U12.8(B9) U21.18(B1)
B10: U12.7(B10) U21.17(B2)
B11: U12.6(B11) U21.16(B3)
B12: U12.5(B12) U21.15(B4)
CC1: R23.2 USB1.4(CC1)
CC2: R24.2 USB1.10(CC2)
GPIO2: R28.2 U13.4(GPIO2)
GPIO3: C25.2 SW2.1 U13.5(GPIO3)
GPIO4: H1.3 U13.6(GPIO4)
GPIO5: H1.2 U13.7(GPIO5)
GPIO6: C26.2 SW3.1 U13.8(GPIO6)
GPIO7: FPC1.1 H3.3 U13.9(GPIO7)
GPIO8: FPC1.3 H3.4 U13.11(GPIO8)
GPIO9: FPC1.5 H3.5 U13.12(GPIO9)
GPIO10: FPC1.7 H3.6 U13.13(GPIO10) U26.5(A1)
GPIO11: FPC1.9 H3.7 U13.14(GPIO11) U26.4(A2)
GPIO14: U13.17(GPIO14) U21.8(A7)
GPIO15: U13.18(GPIO15) U21.7(A6)
GPIO16: U13.27(GPIO16) U21.6(A5)
GPIO17: U13.28(GPIO17) U21.5(A4)
GPIO18: U13.29(GPIO18) U21.4(A3)
GPIO19: U13.30(GPIO19) U21.3(A2)
GPIO20: U13.31(GPIO20) U21.2(A1)
GPIO21: U13.32(GPIO21) U17.9(A8)
GPIO22: U13.34(GPIO22) U17.8(A7)
GPIO23: U13.35(GPIO23) U17.7(A6)
GPIO24: U13.36(GPIO24) U17.6(A5)
GPIO25: U13.37(GPIO25) U17.5(A4)
GPIO26_ADC0: U13.38(GPIO26_ADC0) U17.4(A3)
GPIO27_ADC1: U13.39(GPIO27_ADC1) U17.3(A2)
GPIO28_ADC2: U13.40(GPIO28_ADC2) U17.2(A1)
GPIO29_ADC3: R29.2 U13.41(GPIO29_ADC3)
INPUT_HI: R10.1 U24.3(Y) U24.13(X)
OR: U12.4(OR) U21.14(B5)
POL: U12.3(POL) U21.13(B6)
QSPI_SCLK: U13.52(QSPI_SCLK) U23.6(CLK)
QSPI_SD0: U13.53(QSPI_SD0) U23.5(DI/IO0)
QSPI_SD1: U13.55(QSPI_SD1) U23.2(DO/IO1)
QSPI_SD2: U13.54(QSPI_SD2) U23.3(IO2)
QSPI_SD3: U13.51(QSPI_SD3) U23.7(IO3)
QSPI_SS: R17.2 U13.56(QSPI_SS) U23.1(/CS)
REF_IN+: R13.2 U12.36(REF IN+)
RUN: U13.26(RUN)
RX: H6.2 U13.3(GPIO1)
SCL0: FPC1.8 H5.3 R21.2 U13.16(GPIO13)
SDA0: FPC1.6 H5.4 R22.2 U13.15(GPIO12)
STATUS: U12.2(STATUS) U21.12(B7)
SWCLK: U13.24(SWCLK)
SWDIO: U13.25(SWD)
TX: H6.3 U13.2(GPIO0)
USB_DM: R9.1 USB1.5(DN2) USB1.7(DN1)
USB_DP: R8.1 USB1.6(DP1) USB1.8(DP2)
V_DIV: CN2.1 H2.5 R6.2
V_INPUT_HI: U7.2(-IN) U7.6(OUT) U24.5(Y1)
X0: H4.5 U24.12(X0)
X1: H4.6 U24.14(X1)
X2: H4.7 U24.15(X2)
X3: H4.4 U24.11(X3)
XIN: C27.1 R19.1 U13.20(XIN) X2.1(OSC1)
XOUT: R18.1 R19.2 U13.21(XOUT)
Y3: H4.3 U24.4(Y3)
$1N916: U12.23(OSC OUT) X1.2(OSC2)
$1N922: U12.22(OSC IN) X1.1(OSC1)
$1N1357: U12.38(REF CAP-) U15.2
$1N1363: U12.37(REF CAP+) U15.1
$1N1918: R11.1 U12.30(BUFFER)
$1N2068: U12.32(INTEGRATOR) U19.1
$1N2072: R11.2 U18.2 U19.2
$1N4962: R12.1 U20.6(VOUT)
$1N5333: C18.1 R12.2 R13.1 R14.2
$1N7971: D3.1 R6.1 R7.2 U7.3(+IN)
$1N20556: LED3.2(A) R30.2
$1N26767: U12.31(AUTO-ZERO) U18.1
$1N28381: D2.1 R3.1 R4.2 U2.3(+IN)
$1N51634: R10.2 U12.35(INPUT HI) U16.1
$1N51676: R1.1 R2.2 U1.2(-IN)
$1N71598: D5.2(A) USB1.2(VBUS) USB1.11(VBUS)
$1N71599: C29.2 D4.1(K) D5.1(K) R27.2 U27.5(VIN) U27.8(VINA)
$1N71606: R27.1 U27.6(EN)
$1N71609: U27.4(LX1) U28.1
$1N71648: R8.2 U13.47(USB_DP)
$1N71649: R9.2 U13.46(USB_DM)
$1N71700: C22.1 R18.2 X2.3(OSC2)
$1N71710: R16.1 R17.1 SW1.2
$1N71729: U27.2(LX2) U28.2
$1N71730: R25.2 R26.1 U27.10(FB)
$1N77886: C14.2 U14.5(CFLY+)
$1N77891: C14.1 U14.3(CFLY-)
$1N87374: R14.1 R15.1
$1N122348: LED1.2(+) R28.1
$1N122459: LED2.2(+) R29.1

Not connected (* = marked no-connect by the designer): FPC1 10 13 14; H7 2; SW2 3 4 5; SW3 3 4 5; U1 1(VOS_TRIM) 5(OVER_COMP) 8(VOS_TRIM); U2 1(VOS_TRIM) 5(OVER_COMP) 8(VOS_TRIM); U7 1(VOS_TRIM) 5(OVER_COMP) 8(VOS_TRIM); U12 25(BUF OSC OUT) 29(REF OUT); U20 1(DNC) 3(DNC) 5(TRIM) 7(DNC) 8(DNC); U21 9(A8) 11(B8); U27 7(PS); USB1 3(SBU2) 9(SBU1); X2 2(GND) 4(GND)

## Notes on the sheet
- 当OE = L，DIR = L：A侧为输出，B侧为输入，A = B（B侧输入决定A侧输出）。
  当OE = L，DIR = H：A侧为输入，B侧为输出，B = A（A侧输入决定B侧输出）。
  当OE = H：A侧和B侧均为高阻态（Z）。
